# EasyEDA Pro project 分电板.eprj

# Schematic Schematic1
Board Name: Board1; Create Date: 2024-09-25
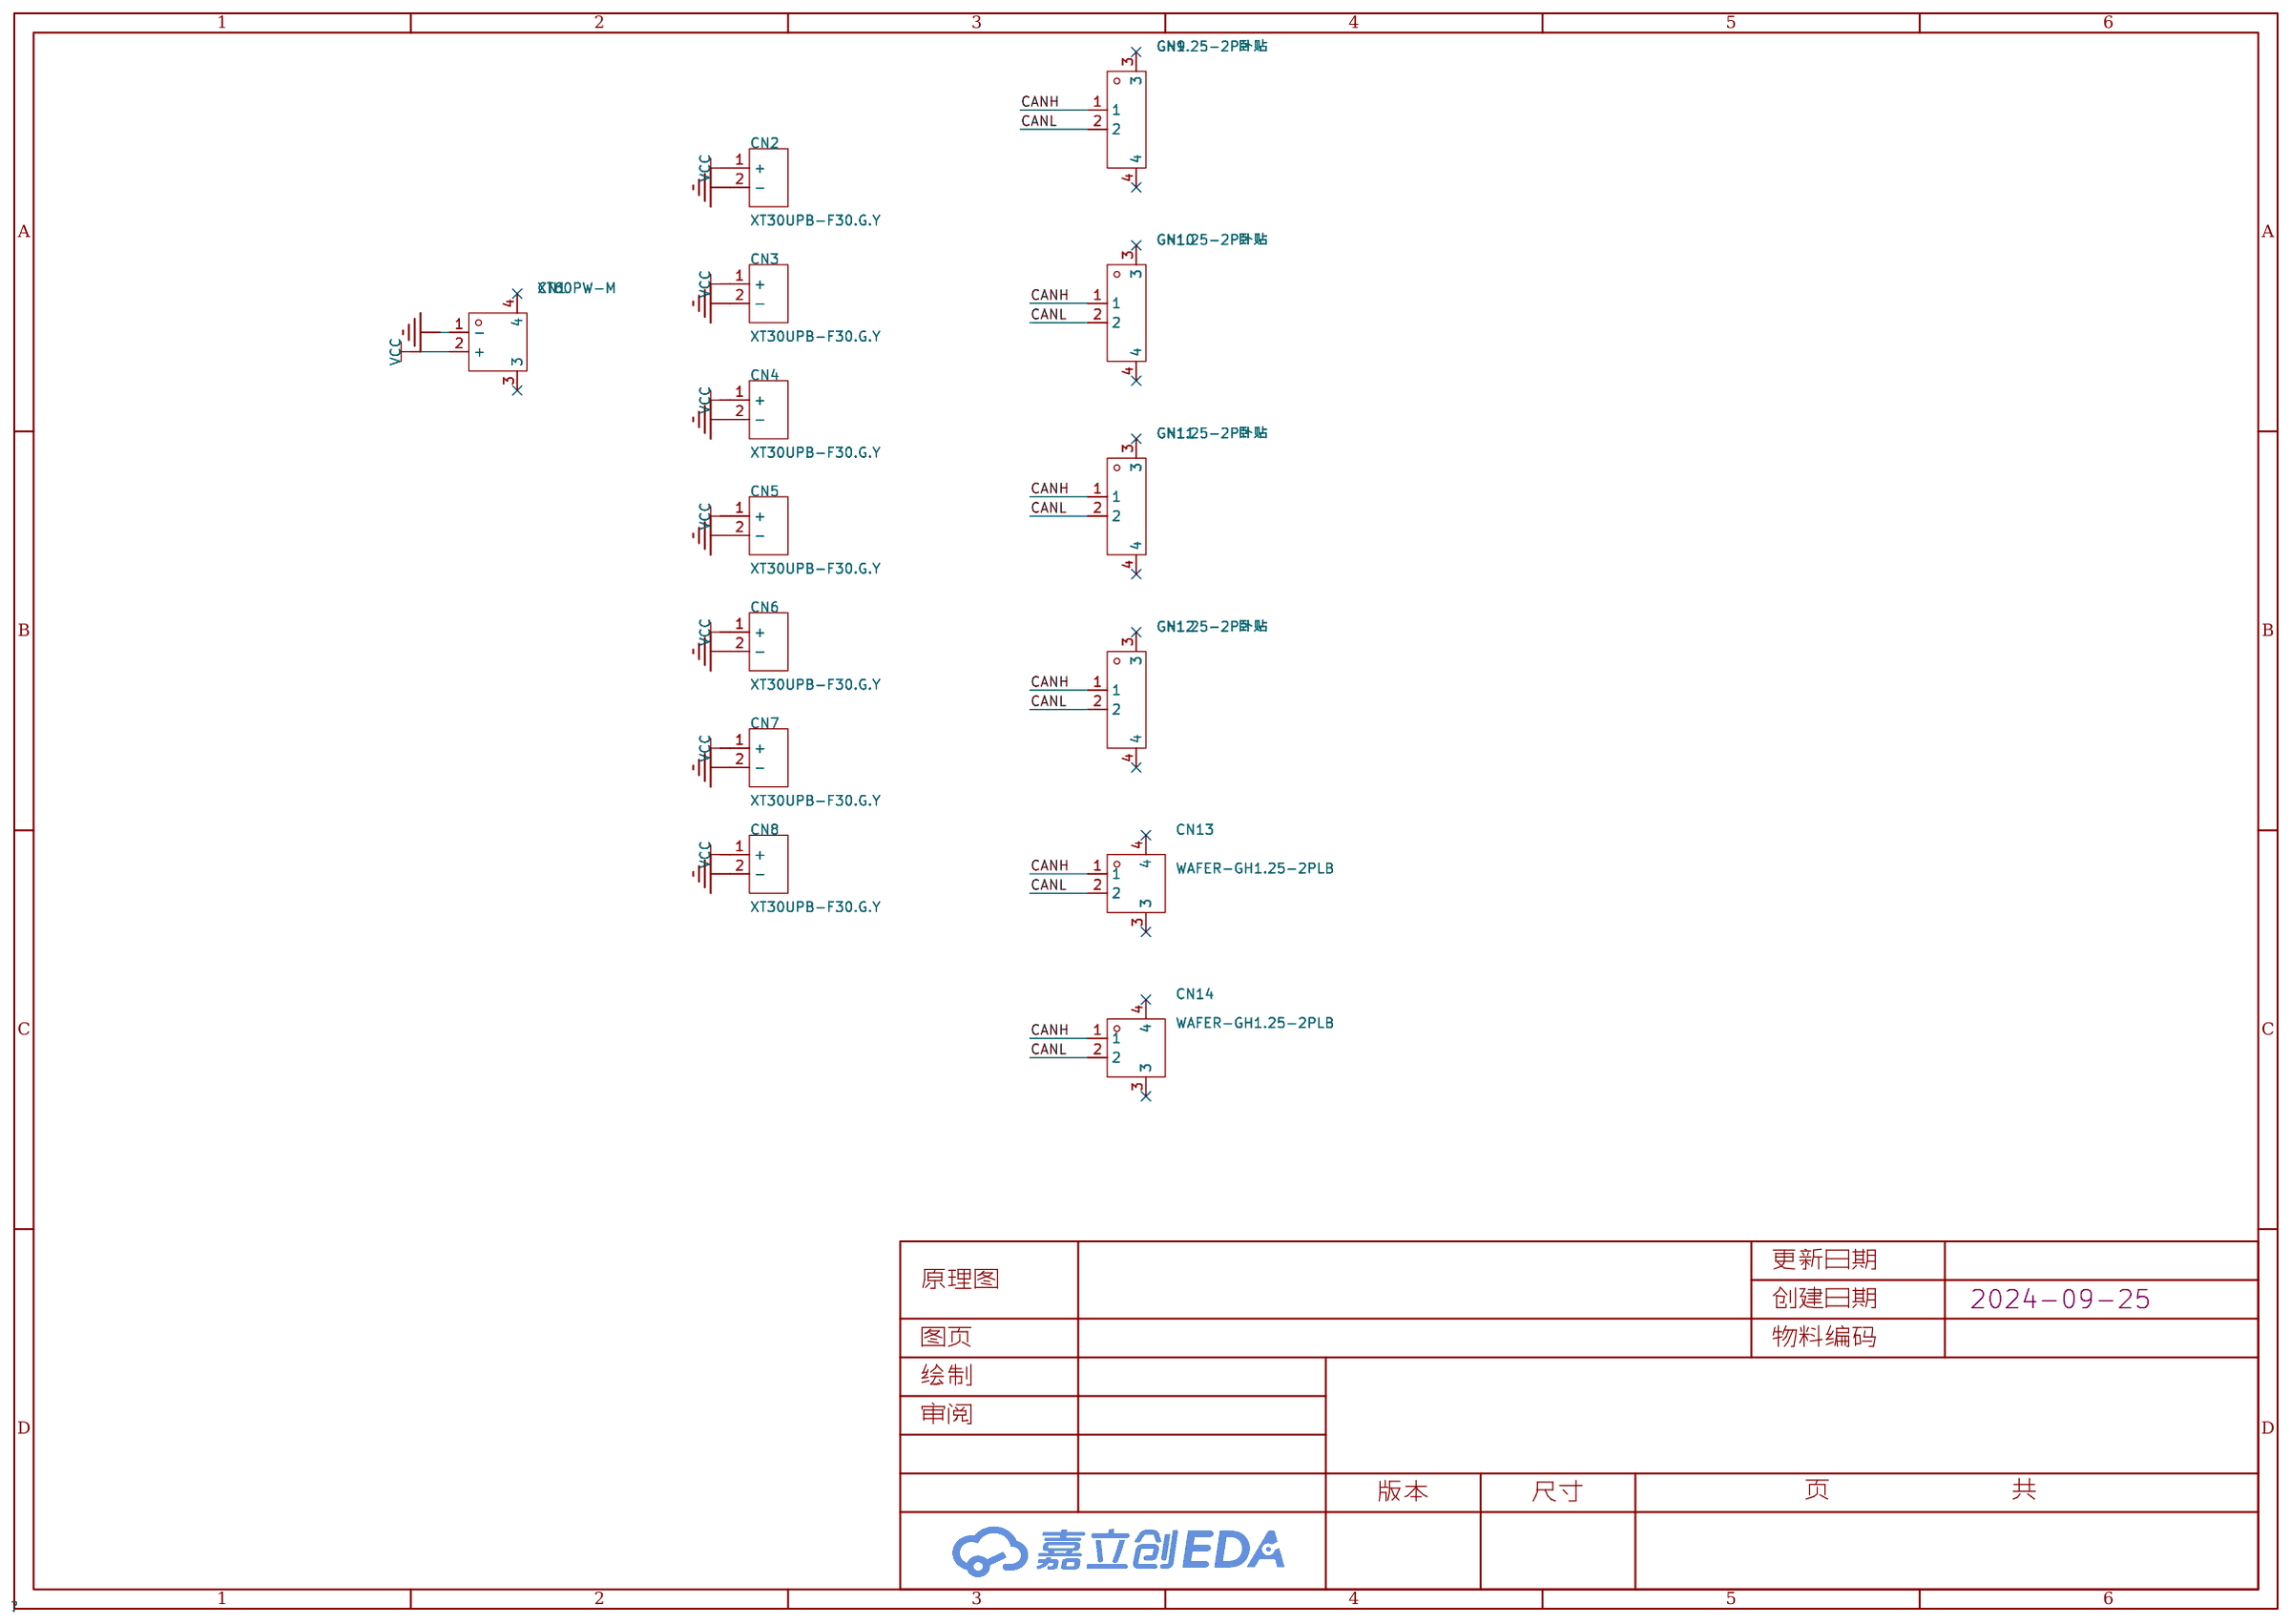
[diagram p0: schematic sheet]

## Parts
CN1  XT60PW-M  [CONN-TH_XT60PW-M]
CN2  XT30UPB-F30.G.Y  [CONN-TH_XT30UPB-F]
CN3  XT30UPB-F30.G.Y  [CONN-TH_XT30UPB-F]
CN4  XT30UPB-F30.G.Y  [CONN-TH_XT30UPB-F]
CN5  XT30UPB-F30.G.Y  [CONN-TH_XT30UPB-F]
CN6  XT30UPB-F30.G.Y  [CONN-TH_XT30UPB-F]
CN7  XT30UPB-F30.G.Y  [CONN-TH_XT30UPB-F]
CN8  XT30UPB-F30.G.Y  [CONN-TH_XT30UPB-F]
CN9  GH1.25-2P卧贴  [CONN-SMD_2P-P1.25_X1251WRS-02HF-LPSW]
CN10  GH1.25-2P卧贴  [CONN-SMD_2P-P1.25_X1251WRS-02HF-LPSW]
CN11  GH1.25-2P卧贴  [CONN-SMD_2P-P1.25_X1251WRS-02HF-LPSW]
CN12  GH1.25-2P卧贴  [CONN-SMD_2P-P1.25_X1251WRS-02HF-LPSW]
CN13  WAFER-GH1.25-2PLB  [CONN-TH_2P-P1.25_XUNPU_WAFER-GH1.25-2PLB]
CN14  WAFER-GH1.25-2PLB  [CONN-TH_2P-P1.25_XUNPU_WAFER-GH1.25-2PLB]

## Library data of the parts
CN1 = XT60PW-M: LCSC Part Name: AMASS(艾迈斯)航模插头xt60连接器150公母对接pw锂电池公头 板插卧式XT60PW-M; Supplier Part: C98732; Manufacturer: AMASS(艾迈斯); JLCPCB Part Class: 扩展库; Datasheet: https://atta.szlcsc.com/upload/public/pdf/source/20240118/44A3DCFF53BE25DC65378AFFB21277A4.pdf; Supplier: LCSC; Brand: 艾迈斯; Type: 卧式插头; Colour: 黄色; InterfaceType: 公头
CN2-CN8 = XT30UPB-F30.G.Y: LCSC Part Name: AMASS(艾迈斯)直立焊板式连接器XT30UPB30-F.G.*; Supplier Part: C108769; Manufacturer: AMASS(艾迈斯); JLCPCB Part Class: 扩展库; Datasheet: https://atta.szlcsc.com/upload/public/pdf/source/20220715/AFD68B9E8B6CA95A7295DBF4AF9325E4.pdf; Supplier: LCSC; Brand: 艾迈斯; Type: 航模插头; Colour: 黄色; RatedVoltage: DC 500V; InterfaceType: 母头; MetalMaterial: 镀金; InsulationMaterial: PA; RatedCurrent: 15A; contact resistance: 0.65mΩ
CN9-CN12 = GH1.25-2P卧贴_C9900015099: Supplier Part: C9900015099; JLCPCB Part Class: 扩展库; Supplier: LCSC
CN13 CN14 = WAFER-GH1.25-2PLB: LCSC Part Name: 1x2P 间距:1.25mm 立贴 系列:GH; Supplier Part: C3029368; Manufacturer: XUNPU(讯普); Supplier Footprint: SMD,P=1.25mm; JLCPCB Part Class: 扩展库; Datasheet: https://atta.szlcsc.com/upload/public/pdf/source/20220527/44F824AAC8C2B617205E15955FF9C23D.pdf; Supplier: LCSC; Pins Structure: 1x2P; Pitch: 1.25mm; Mounting Style: 立贴; Reference Series: GH; Number of Pins: 2P; Number of Rows: 1; Number of PINs Per Row: 2; Current Rating (Max): 1A; Operating Temperature Range: -25℃~+85℃

## Nets
GND: CN1.1(-) CN2.2(-) CN3.2(-) CN4.2(-) CN5.2(-) CN6.2(-) CN7.2(-) CN8.2(-)
VCC: CN1.2(+) CN2.1(+) CN3.1(+) CN4.1(+) CN5.1(+) CN6.1(+) CN7.1(+) CN8.1(+)
CANH: CN9.1 CN10.1 CN11.1 CN12.1 CN13.1 CN14.1
CANL: CN9.2 CN10.2 CN11.2 CN12.2 CN13.2 CN14.2

Not connected (* = marked no-connect by the designer): CN1 3* 4*; CN9 3* 4*; CN10 3* 4*; CN11 3* 4*; CN12 3* 4*; CN13 3* 4*; CN14 3* 4*

# Board PCB1
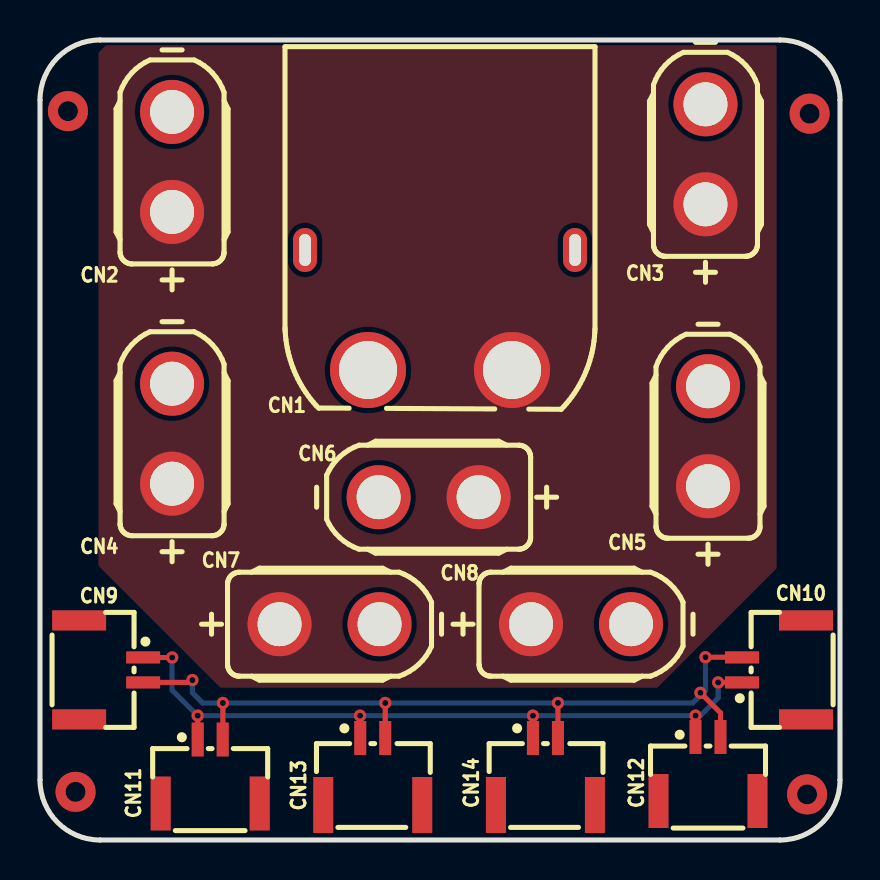
[diagram p1: board, top side]
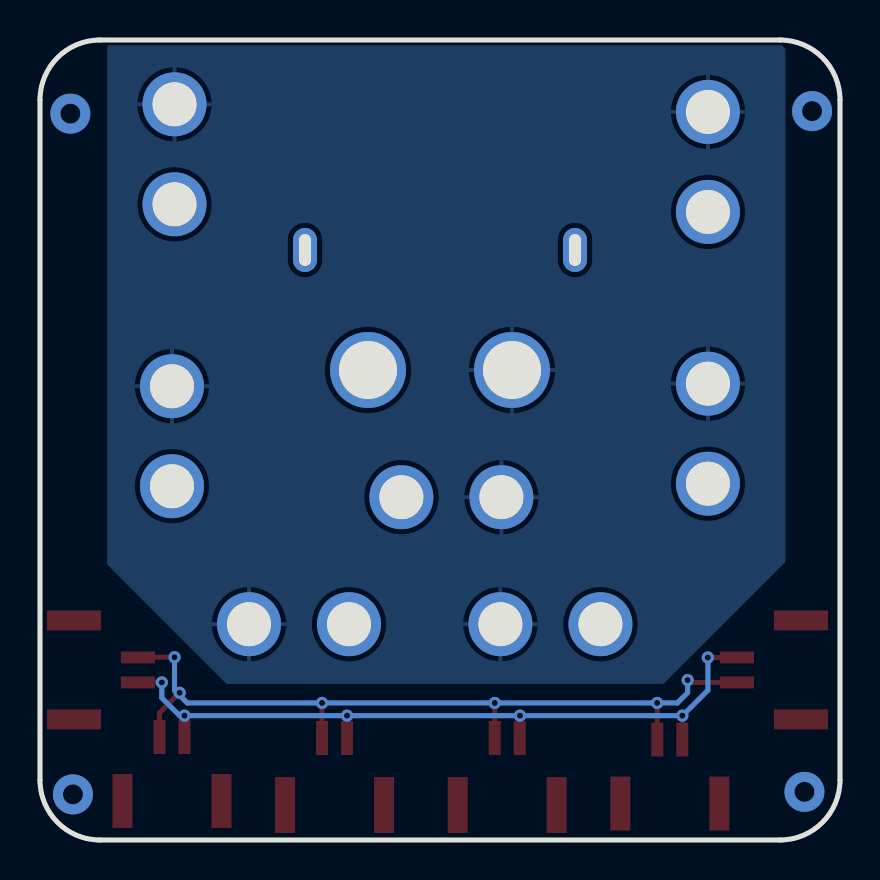
[diagram p2: board, bottom side, seen from below]

Outline 40 x 40 mm; copper layers: Top Layer, Bottom Layer. Coordinates in mm from the lower left corner of the outline.
Outline path: 0,37 0,3 arc(0.88,0.88) 3,0 37,0 arc(39.12,0.88) 40,3 40,37 arc(39.12,39.12) 37,40 3,40 arc(0.88,39.12) 0,37
Stack: Top Layer 0.035mm / Dielectric1 1.51mm FR4 er 4.5 / Bottom Layer 0.035mm

## Design rules (mm)
template: JLCPCB Capability(Two Layers Board)
spacing copperThickness1oz (default): track to track 0.102, other pairs 0.152 to 0.3
spacing copperThickness2oz: track to track 0.203, other pairs 0.152 to 0.3
track width copperThickness1oz (default): min 0.127, default 0.254, max 2.54
track width copperThickness2oz: min 0.203, default 0.254, max 2.54
differential pair differentialPair (default): width min 0.127, default 0.254, max 2.54; gap min 0.152, default 0.152
via viaSize (default): diameter min 0.5, default 0.61, max 10; hole min 0.3, default 0.305, max 6.3

## Placement (name value [footprint] x y rotation side)
CN1  XT60PW-M  [CONN-TH_XT60PW-M]  20 26.5 270 top
CN2  XT30UPB-F30.G.Y  [CONN-TH_XT30UPB-F]  6.6 33.9 90 top
CN3  XT30UPB-F30.G.Y  [CONN-TH_XT30UPB-F]  33.27 34.28 90 top
CN4  XT30UPB-F30.G.Y  [CONN-TH_XT30UPB-F]  6.6 20.31 90 top
CN5  XT30UPB-F30.G.Y  [CONN-TH_XT30UPB-F]  33.4 20.19 90 top
CN6  XT30UPB-F30.G.Y  [CONN-TH_XT30UPB-F]  19.43 17.14 180 top
CN7  XT30UPB-F30.G.Y  [CONN-TH_XT30UPB-F]  14.48 10.79 0 top
CN8  XT30UPB-F30.G.Y  [CONN-TH_XT30UPB-F]  27.05 10.79 0 top
CN9  GH1.25-2P卧贴  [CONN-SMD_2P-P1.25_X1251WRS-02HF-LPSW]  3.56 8.5 270 top
CN10  GH1.25-2P卧贴  [CONN-SMD_2P-P1.25_X1251WRS-02HF-LPSW]  36.7 8.5 90 top
CN11  GH1.25-2P卧贴  [CONN-SMD_2P-P1.25_X1251WRS-02HF-LPSW]  8.51 3.42 0 top
CN12  GH1.25-2P卧贴  [CONN-SMD_2P-P1.25_X1251WRS-02HF-LPSW]  33.4 3.55 0 top
CN13  WAFER-GH1.25-2PLB  [CONN-TH_2P-P1.25_XUNPU_WAFER-GH1.25-2PLB]  16.64 3.42 0 top
CN14  WAFER-GH1.25-2PLB  [CONN-TH_2P-P1.25_XUNPU_WAFER-GH1.25-2PLB]  25.27 3.42 0 top

## Footprints (pads in the part's own frame, mm; a bottom-side part is the same pattern mirrored in y, then rotated)
CONN-SMD_2P-P1.25_X1251WRS-02HF-LPSW
  rect 0.6x1.7 smd: 1(-0.625,1.6) 2(0.625,1.6)
  rect 1x2.7 smd: 3(2.475,-1.6) 4(-2.475,-1.6)
CONN-TH_2P-P1.25_XUNPU_WAFER-GH1.25-2PLB
  rect 0.6x1.7 smd: 1(-0.625,1.675) 2(0.625,1.675)
  rect 1x2.8 smd: 3(2.475,-1.675) 4(-2.475,-1.675)
CONN-TH_XT30UPB-F
  round 3.2 hole 2.2: 1(-2.5,0) 2(2.5,0)
CONN-TH_XT60PW-M
  round 3.8 hole 2.9: 1(3,-3.6) 2(3,3.6)
  oval 2.2x1.2 hole 1.6x0.6: 3(-3,6.75) 4(-3,-6.75)

## Nets
As in the schematic.

Pads without a net: CN1 3 4; CN9 3 4; CN10 3 4; CN11 3 4; CN12 3 4; CN13 3 4; CN14 3 4

## Via types
v1: diameter 2, hole 1, Top Layer to Bottom Layer, 4 vias
v2: diameter 0.61, hole 0.305, Top Layer to Bottom Layer, 12 vias

## Routing (per net, layer and track width the routed paths; a pad name or vN(x,y) marks a point on that pad's centre or on a via; arc(x,y) is an arc through that point)
(no net):
  vias: v1(1.4,36.44) v1(1.78,2.41) v1(38.35,2.28) v1(38.48,36.32)
CANH: length 37.9
  Top Layer w0.254: CN10.1 v2(33.91,7.88) ; CN14.1 v2(24.65,6.22) ; CN11.1 v2(7.88,6.22) ; CN12.1 v2(32.78,6.22) ; CN9.1 5.16,9.12 v2(6.61,9.12) ; v2(16,6.22) 16.01,6.21 CN13.1
  Bottom Layer w0.254: 33.91,8 33.91,7.11 33.02,6.22 v2(24.65,6.22) v2(16,6.22) 7.87,6.22 6.6,7.49 6.6,9.14
CANL: length 40.7
  Top Layer w0.254: v2(33.27,9.14) 35.09,9.14 CN10.2 ; CN14.2 v2(25.9,6.85) ; CN9.2 7.5,7.88 v2(7.62,8) ; CN12.2 34.03,6.36 v2(33.02,7.36) ; v2(9.14,6.85) 9.14,5.03 CN11.2 ; CN13.2 v2(17.26,6.85)
  Bottom Layer w0.254: v2(7.62,8) 7.62,7.36 8.13,6.85 v2(9.14,6.85) v2(17.26,6.85) v2(25.9,6.85) 32.64,6.85 33.27,7.49 v2(33.27,9.14)

## Copper pours and planes (outline as drawn; the poured copper is in the pictures)
GND on Bottom Layer: 3.11,39.94 36.64,39.94 36.64,13.77 30.67,7.81 8.83,7.81 2.73,13.9 2.73,39.56
VCC on Top Layer: 22.35,12.95 26.65,12.95 26.65,8.65 22.35,8.65
VCC on Top Layer: 9.65,12.95 14.35,12.95 14.35,8.76 9.65,8.76
VCC on Top Layer: 20.83,26.16 26.67,26.16 26.67,20.95 20.83,20.95
VCC on Top Layer: 19.83,19.44 24,19.44 24,14.98 19.83,14.98
VCC on Top Layer: 30.67,34.06 36.06,34.06 36.06,29.18 30.67,29.18
VCC on Top Layer: 4.46,19.92 8.89,19.92 8.89,15.74 4.46,15.74
VCC on Top Layer: 3.3,39.75 36.83,39.75 36.83,13.58 30.86,7.61 9.02,7.61 2.92,13.71 2.92,39.36
VCC on Top Layer: 4.44,34.03 8.89,34.03 8.89,29.2 4.44,29.2
VCC on Top Layer: 31.12,20.19 36.7,20.19 36.7,14.73 31.12,14.73
